# EAGLE design MCMP_Projeto_Final (EAGLE 9.6.2)
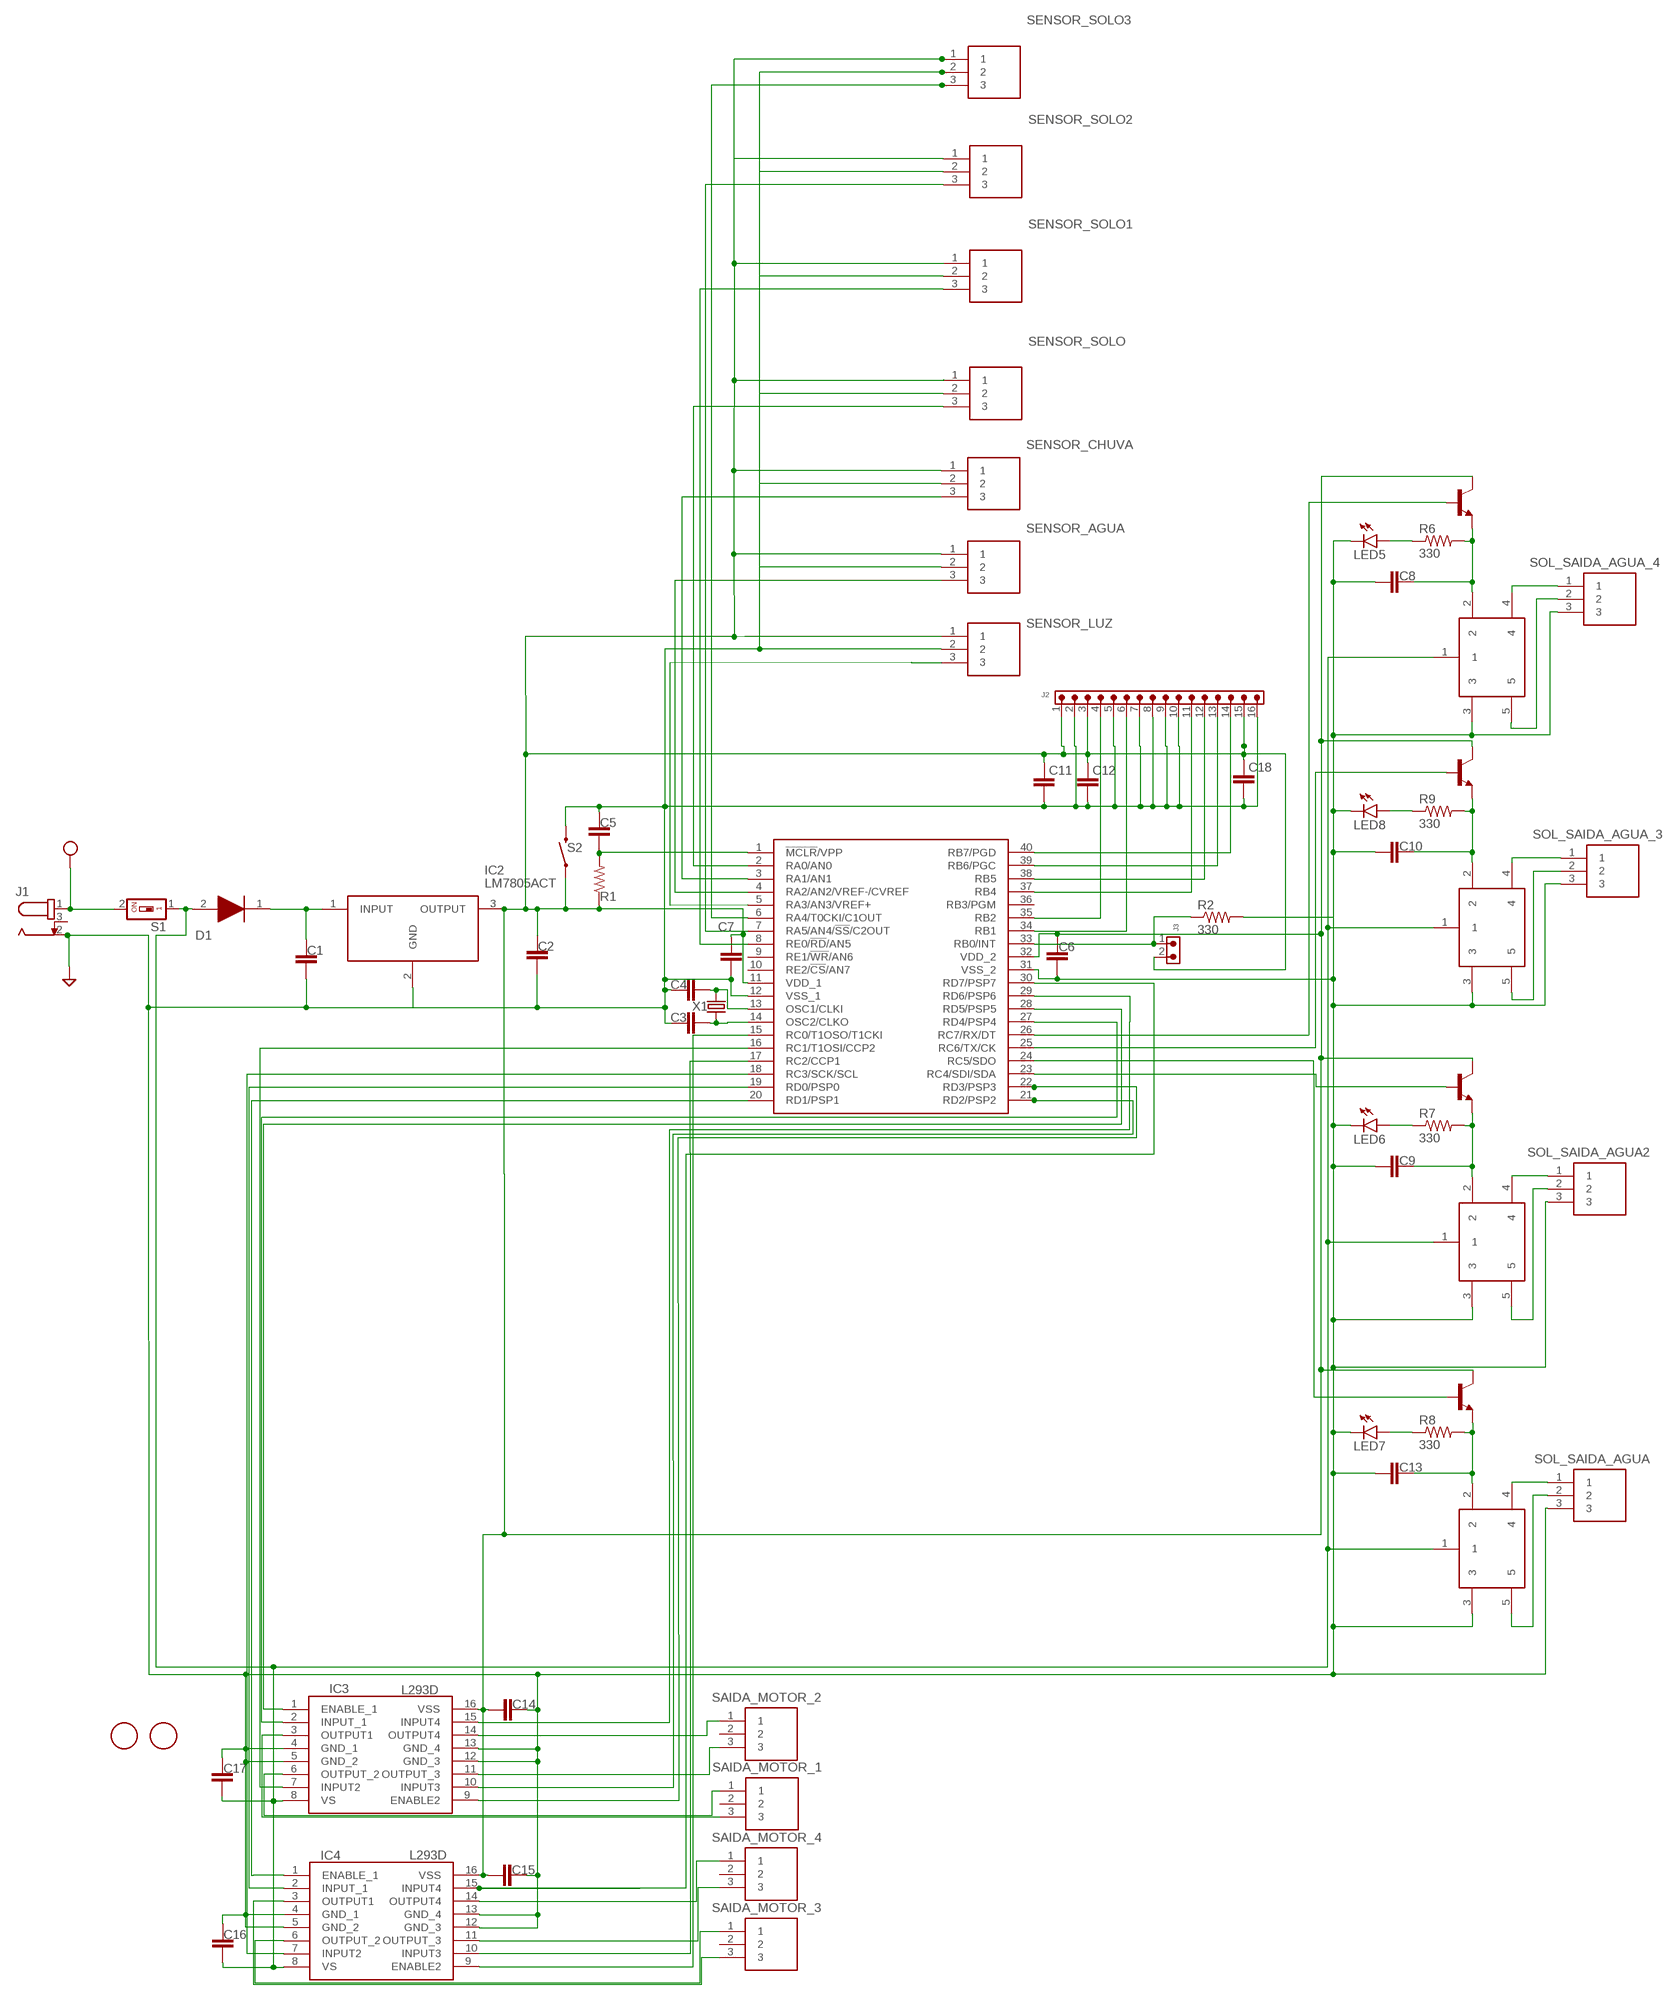
[diagram p0: schematic, sheet 1]

## Parts
C1  470uF  CC0805KRX7R9BB104  [CAP_0805]
C2  1uF  CC0805KRX7R9BB104  [CAP_0805]
C3  33p  CC0805KRX7R9BB104  [CAP_0805]
C4  33p  CC0805KRX7R9BB104  [CAP_0805]
C5  10u  CC0805KRX7R9BB104  [CAP_0805]
C6  10u  CC0805KRX7R9BB104  [CAP_0805]
C7  10u  CC0805KRX7R9BB104  [CAP_0805]
C8  10u  CC0805KRX7R9BB104  [CAP_0805]
C9  10u  CC0805KRX7R9BB104  [CAP_0805]
C10  10u  CC0805KRX7R9BB104  [CAP_0805]
C11  10u  CC0805KRX7R9BB104  [CAP_0805]
C12  10u  CC0805KRX7R9BB104  [CAP_0805]
C13  10u  CC0805KRX7R9BB104  [CAP_0805]
C14  0.1u  CC0805KRX7R9BB104  [CAP_0805]
C15  0.1u  CC0805KRX7R9BB104  [CAP_0805]
C16  100u  CC0805KRX7R9BB104  [CAP_0805]
C17  100u  CC0805KRX7R9BB104  [CAP_0805]
C18  10u  CC0805KRX7R9BB104  [CAP_0805]
D1  1N4007S  [DIOAD1470W65L470D250]
IC1  PIC16F877A-I_P  [DIP1550W56P254L5219H483Q40N]
IC2  LM7805ACT  [TO254P470X1016X2019-3P]
IC3  L293D  [DIP880W50P254L2000H510Q16N]
IC4  L293D  [DIP880W50P254L2000H510Q16N]
J1  694106301002  [694106301002]
J2  6130XX11121_61301611121  [61301611121]
J3  6200XX11121_62000211121  [62000211121]
K1  SRD-05VDC-SL-C  [SRD]
K2  SRD-05VDC-SL-C  [SRD]
K3  SRD-05VDC-SL-C  [SRD]
K5  SRD-05VDC-SL-C  [SRD]
LED5  LEDCHIPLED_0805  [CHIPLED_0805]
LED6  LEDCHIPLED_0805  [CHIPLED_0805]
LED7  LEDCHIPLED_0805  [CHIPLED_0805]
LED8  LEDCHIPLED_0805  [CHIPLED_0805]
Q1  2N1711  [TO39]
Q2  2N1711  [TO39]
Q3  2N1711  [TO39]
Q5  2N1711  [TO39]
R1  10k  CRCW08050000Z0EA  [RES_0805]
R2  330  CRCW08050000Z0EA  [RES_0805]
R6  330  CRCW08050000Z0EA  [RES_0805]
R7  330  CRCW08050000Z0EA  [RES_0805]
R8  330  CRCW08050000Z0EA  [RES_0805]
R9  330  CRCW08050000Z0EA  [RES_0805]
S1  SWS001  [SMS-001]
S2  MOMENTARY-SWITCH-SPST-PTH-6.0MM  [TACTILE_SWITCH_PTH_6.0MM]
SAIDA_MOTOR_1  TB005-762-03BE  [SHDR3W100P0X762_1X3_2286X1260X]
SAIDA_MOTOR_2  TB005-762-03BE  [SHDR3W100P0X762_1X3_2286X1260X]
SAIDA_MOTOR_3  TB005-762-03BE  [SHDR3W100P0X762_1X3_2286X1260X]
SAIDA_MOTOR_4  TB005-762-03BE  [SHDR3W100P0X762_1X3_2286X1260X]
SENSOR_AGUA  TB005-762-03BE  [SHDR3W100P0X762_1X3_2286X1260X]
SENSOR_CHUVA  TB005-762-03BE  [SHDR3W100P0X762_1X3_2286X1260X]
SENSOR_LUZ  TB005-762-03BE  [SHDR3W100P0X762_1X3_2286X1260X]
SENSOR_SOLO  TB005-762-03BE  [SHDR3W100P0X762_1X3_2286X1260X]
SENSOR_SOLO1  TB005-762-03BE  [SHDR3W100P0X762_1X3_2286X1260X]
SENSOR_SOLO2  TB005-762-03BE  [SHDR3W100P0X762_1X3_2286X1260X]
SENSOR_SOLO3  TB005-762-03BE  [SHDR3W100P0X762_1X3_2286X1260X]
SOL_SAIDA_AGUA  TB005-762-03BE  [SHDR3W100P0X762_1X3_2286X1260X]
SOL_SAIDA_AGUA2  TB005-762-03BE  [SHDR3W100P0X762_1X3_2286X1260X]
SOL_SAIDA_AGUA_3  TB005-762-03BE  [SHDR3W100P0X762_1X3_2286X1260X]
SOL_SAIDA_AGUA_4  TB005-762-03BE  [SHDR3W100P0X762_1X3_2286X1260X]
U$5  FIDUCIAL  [FIDUCIAL_1MM]
U$6  FIDUCIAL  [FIDUCIAL_1MM]
X1  4Mhz  5032/2P  [5032/2P]

## Nets
ACIONA_BOBINA_1: IC1.24(RC5/SDO) Q5.2(B)
ACIONA_BOBINA_2: IC1.23(RC4/SDI/SDA) Q2.2(B)
ACIONA_BOBINA_3: IC1.25(RC6/TX/CK) Q3.2(B)
ACIONA_BOBINA_4: IC1.26(RC7/RX/DT) Q1.2(B)
ENABLE_MOTOR_1: IC1.28(RD5/PSP5) IC3.1(ENABLE_1)
ENABLE_MOTOR_2: IC1.22(RD3/PSP3) IC3.9(ENABLE2)
ENABLE_MOTOR_3: IC1.20(RD1/PSP1) IC4.1(ENABLE_1)
ENABLE_MOTOR_4: IC1.15(RC0/T1OSO/T1CKI) IC4.9(ENABLE2)
GND: C1.2 C2.2 C3.1 C4.1 C5.1 C6.2 C7.2 C8.2 C9.2 C10.2 C11.2 C12.2 C13.2 C14.2 C15.1 C16.1 C17.1 C18.2 IC1.12(VSS_1) IC1.31(VSS_2) IC2.2(GND) IC3.4(GND_1) IC3.5(GND_2) IC3.12(GND_3) IC3.13(GND_4) IC4.4(GND_1) IC4.5(GND_2) IC4.12(GND_3) IC4.13(GND_4) J1.2 J2.2 J2.5 J2.7 J2.8 J2.9 J2.10 J2.16 K1.3 K2.3 K3.3 K5.3 LED5.C LED6.C LED7.C LED8.C R2.2 S2.3 SENSOR_AGUA.2 SENSOR_CHUVA.2 SENSOR_LUZ.2 SENSOR_SOLO1.2 SENSOR_SOLO2.2 SENSOR_SOLO3.2 SENSOR_SOLO.2 SOL_SAIDA_AGUA2.3 SOL_SAIDA_AGUA.3 SOL_SAIDA_AGUA_3.3 SOL_SAIDA_AGUA_4.3
INPUT1_MOTOR_1: IC1.27(RD4/PSP4) IC3.2(INPUT_1)
INPUT1_MOTOR_2: IC1.21(RD2/PSP2) IC3.10(INPUT3)
INPUT1_MOTOR_3: IC1.19(RD0/PSP0) IC4.2(INPUT_1)
INPUT1_MOTOR_4: IC1.17(RC2/CCP1) IC4.10(INPUT3)
INPUT2_MOTO_1: IC1.16(RC1/T1OSI/CCP2) IC3.7(INPUT2)
INPUT2_MOTOR_2: IC1.29(RD6/PSP6) IC3.15(INPUT4)
INPUT2_MOTOR_3: IC1.18(RC3/SCK/SCL) IC4.7(INPUT2)
INPUT2_MOTOR_4: IC1.30(RD7/PSP7) IC4.15(INPUT4)
N$1: C1.1 D1.1(K) IC2.1(INPUT)
N$2: IC1.8(RE0/!RD!/AN5) SENSOR_SOLO1.3
N$3: IC1.7(RA5/AN4/!SS!/C2OUT) SENSOR_SOLO2.3
N$4: C5.2 IC1.1(!MCLR!/VPP) R1.2
N$5: C4.2 IC1.13(OSC1/CLKI) X1.2
N$6: C3.2 IC1.14(OSC2/CLKO) X1.1
N$7: IC1.2(RA0/AN0) SENSOR_SOLO.3
N$8: K5.4 SOL_SAIDA_AGUA.1
N$9: IC1.6(RA4/T0CKI/C1OUT) SENSOR_SOLO3.3
N$10: IC1.33(RB0/INT) J3.1 R2.1
N$16: IC1.3(RA1/AN1) SENSOR_CHUVA.3
N$18: IC1.4(RA2/AN2/VREF-/CVREF) SENSOR_AGUA.3
N$21: K1.4 SOL_SAIDA_AGUA_4.1
N$22: LED8.A R9.1
N$24: LED5.A R6.1
N$25: C8.1 K1.2 Q1.1(E) R6.2
N$26: K1.5 SOL_SAIDA_AGUA_4.2
N$27: C13.1 K5.2 Q5.1(E) R8.2
N$30: K5.5 SOL_SAIDA_AGUA.2
N$32: C10.1 K3.2 Q3.1(E) R9.2
N$33: LED6.A R7.1
N$34: C9.1 K2.2 Q2.1(E) R7.2
N$35: K2.4 SOL_SAIDA_AGUA2.1
N$36: K2.5 SOL_SAIDA_AGUA2.2
N$37: LED7.A R8.1
N$38: K3.4 SOL_SAIDA_AGUA_3.1
N$39: K3.5 SOL_SAIDA_AGUA_3.2
N$53: IC1.5(RA3/AN3/VREF+) SENSOR_LUZ.3
OUTPUT1_MOTOR_1: IC3.3(OUTPUT1) SAIDA_MOTOR_1.3
OUTPUT1_MOTOR_2: IC3.11(OUTPUT_3) SAIDA_MOTOR_2.3
OUTPUT1_MOTOR_3: IC4.3(OUTPUT1) SAIDA_MOTOR_3.3
OUTPUT1_MOTOR_4: IC4.11(OUTPUT_3) SAIDA_MOTOR_4.3
OUTPUT2_MOTOR_1: IC3.6(OUTPUT_2) SAIDA_MOTOR_1.1
OUTPUT2_MOTOR_2: IC3.14(OUTPUT4) SAIDA_MOTOR_2.1
OUTPUT2_MOTOR_3: IC4.6(OUTPUT_2) SAIDA_MOTOR_3.1
OUTPUT2_MOTOR_4: IC4.14(OUTPUT4) SAIDA_MOTOR_4.1
RB1: IC1.34(RB1) J2.6
RB2: IC1.35(RB2) J2.4
RB4: IC1.37(RB4) J2.11
RB5: IC1.38(RB5) J2.12
RB6: IC1.39(RB6/PGC) J2.13
RB7: IC1.40(RB7/PGD) J2.14
VCC: J1.1 S1.2 ; supply symbol labelled VCC-CIRCLE
VCC5: C2.1 C6.1 C7.1 C11.1 C12.1 C14.1 C15.2 C18.1 IC1.11(VDD_1) IC1.32(VDD_2) IC2.3(OUTPUT) IC3.16(VSS) IC4.16(VSS) J2.1 J2.3 J2.15 J3.2 Q1.3(C) Q2.3(C) Q3.3(C) Q5.3(C) R1.1 S2.1 SENSOR_AGUA.1 SENSOR_CHUVA.1 SENSOR_LUZ.1 SENSOR_SOLO1.1 SENSOR_SOLO2.1 SENSOR_SOLO3.1 SENSOR_SOLO.1
VCC12: C16.2 C17.2 D1.2(A) IC3.8(VS) IC4.8(VS) K1.1 K2.1 K3.1 K5.1 S1.1
Unconnected: IC1.9(RE1/!WR!/AN6) IC1.10(RE2/!CS!/AN7) IC1.36(RB3/PGM) J1.3 SAIDA_MOTOR_1.2 SAIDA_MOTOR_2.2 SAIDA_MOTOR_3.2 SAIDA_MOTOR_4.2

## Library data of the parts
C1-C18 = Resistor_Capacitor:CC0805KRX7R9BB104: CAP CER 0.1UF 50V X7R 0805 Manufacturer's datasheet <http://www.yageo.com/documents/recent/UPY-GPHC_X7R_6.3V-to-50V_18.pdf>; CREATED_BY: PCBLayout.com; DIGIKEY_PART_NUMBER: 311-1140-2-ND; MANUFACTURER: Yageo; MPN: CC0805KRX7R9BB104; PACKAGE: SMD 0805
D1 = SamacSys_Parts:1N4007S: Rectifiers 1A,1000V,Std SILASTIC Rect Source: Datasheet <https://chawlaelectronic.com/wp-content/uploads/2020/11/1N4007S.pdf>; DESCRIPTION: Rectifiers 1A,1000V,Std SILASTIC Rect; HEIGHT: mm; MANUFACTURER_NAME: Taiwan Semiconductor; MANUFACTURER_PART_NUMBER: 1N4007S; MOUSER_PART_NUMBER: 821-1N4007S; MOUSER_PRICE-STOCK: http://www.mouser.com/Search/ProductDetail.aspx?qs=tHU%2flV7kTySzKYFlWk%2f8oQ%3d%3d
IC1 = SamacSys_Parts:PIC16F877A-I_P: 8-Bit CMOS FLASH Microcontrollers Source: Datasheet <http://componentsearchengine.com/Datasheets/1/PIC16F877A-I_P.pdf>; ARROW_PART_NUMBER: PIC16F877A-I/P; ARROW_PRICE-STOCK: https://www.arrow.com/en/products/pic16f877a-ip/microchip-technology; DESCRIPTION: 8-Bit CMOS FLASH Microcontrollers; HEIGHT: 4.83mm; MANUFACTURER_NAME: Microchip; MANUFACTURER_PART_NUMBER: PIC16F877A-I/P; MOUSER_PART_NUMBER: 579-PIC16F877A-I/P; MOUSER_PRICE-STOCK: https://www.mouser.co.uk/ProductDetail/Microchip-Technology/PIC16F877A-I-P?qs=Vn0zuzr35GH%252Bfm6E5Siyuw%3D%3D
IC2 = SamacSys_Parts:LM7805ACT: ON Semiconductor LM7805ACT Linear Voltage Regulator, 1A, 5 V 3-Pin, TO-220 Source: Datasheet <https://componentsearchengine.com/Datasheets/2/LM7805ACT.pdf>; ARROW_PART_NUMBER: LM7805ACT; ARROW_PRICE-STOCK: https://www.arrow.com/en/products/lm7805act/on-semiconductor; DESCRIPTION: ON Semiconductor LM7805ACT Linear Voltage Regulator, 1A, 5 V 3-Pin, TO-220; HEIGHT: 4.7mm; MANUFACTURER_NAME: ON Semiconductor; MANUFACTURER_PART_NUMBER: LM7805ACT; MOUSER_PART_NUMBER: 512-LM7805ACT; MOUSER_PRICE-STOCK: https://www.mouser.co.uk/ProductDetail/ON-Semiconductor-Fairchild/LM7805ACT?qs=VOMQJJE%252BBNlQknJDd4ZVLg%3D%3D
IC3 IC4 = SamacSys_Parts:L293D: L293D, Motor Driver, 4.5 36 V, 16-Pin Power PDIP Source: Datasheet <http://www.st.com/web/en/resource/technical/document/datasheet/CD00000059.pdf>; ARROW_PART_NUMBER: L293D; ARROW_PRICE-STOCK: https://www.arrow.com/en/products/l293d/stmicroelectronics; DESCRIPTION: L293D, Motor Driver, 4.5 36 V, 16-Pin Power PDIP; HEIGHT: 5.1mm; MANUFACTURER_NAME: STMicroelectronics; MANUFACTURER_PART_NUMBER: L293D; MOUSER_PART_NUMBER: 511-L293D; MOUSER_PRICE-STOCK: https://www.mouser.co.uk/ProductDetail/STMicroelectronics/L293D/?qs=gr8Zi5OG3MgMJ1ICDzLQbg%3D%3D
J1 = DC Power Jacks:694106301002: CONN PWR JACK 2.1X5.5MM SOLDER Manufacturer's datasheet <https://katalog.we-online.de/em/datasheet/6941xx301002.pdf>; CREATED_BY: PCBLayout.com; DIGIKEY_PART_NUMBER: 732-5930-ND; MANUFACTURER: Wurth Electronics Inc.; MPN: 694106301002
J2 = Wurth_Connectors_WR-PHD:6130XX11121_61301611121: WR-PHD 2.54 mm THT Pin Header ARTICLE PROPERTIES: Pins:1;​ 2;​ 3;​ 4;​ 5;​ 6;​ 7;​ 8;​ 9;​ 10;​ 12;​ 13;​ 14;​ 15;​ 16;​ 18;​ 20;​ 22;​ 24;​ 25;​ 32;​ 36;​ 40 KIND PROPERTIES: Pitch：2.54 mm Quality Class:3 as per CECC 75 301-802 Rows：Single Gender：Pin Header Type：Straight MATERIAL PROPERTIES: Insulator Material :PBT Insulator Flammability Rating:UL94 V-0 Contact Material:Copper Alloy Contact Plating:Gold Contact Type:Stamped GENERAL INFORMATION Operating Temperature:-40 up to +105 °C Compliance:RoHS ELECTRICAL PROPERTIES: Rated Current:3 A IR 1:3 A Withstanding Voltage:500 V (AC) Contact Resistance:20 mΩ RISO:1000 MΩ CERTIFICATION UL Approval:E323964 PACKAGING PROPERTIES Packaging:Bag <https://katalog.we-online.com/media/images/v2/o33211v209%20Family_BTB_PHD_6130xx11121.jpg> Details see: https://katalog.we-online.com/en/em/PHD_2_54_THT_PIN_HEADER_6130XX11121 Updated by Yingchun,Shan 2019-10-16 2019 (C) Würth Elektronik; DATASHEET-URL: https://katalog.we-online.com/em/datasheet/61301611121.pdf; GENDER: Pin Header; IR: 3A; MATES: WR-PHD 2.54mm Angled Socket Header /SMT Socket Header/Socket Header; PACKAGING: Bag; PART-NUMBER: 61301611121; PINS: 16; ROWS: Single; TYPE: Straight
J3 = Wurth_Connectors_WR-PHD:6200XX11121_62000211121: WR-PHD 2.00 mm THT Pin Header ARTICLE PROPERTIES: Pins:2;​ 3;​ 4;​ 6;​ 8;​ 10;​ 20;​ 32 KIND PROPERTIES: Pitch：2 mm Quality Class:3 as per CECC 75 301-802 Rows：Single Gender：Pin Header Type：Straight MATERIAL PROPERTIES: Insulator Material :PA9T Insulator Flammability Rating:UL94 V-0 Contact Material:Copper Alloy Contact Plating:Gold Contact Type:Stamped GENERAL INFORMATION Operating Temperature:-40 up to +105 °C Compliance:Lead free / RoHS ELECTRICAL PROPERTIES: Rated Current:max.;​ 2 A IR 1:2A Withstanding Voltage:500 V (AC) Contact Resistance:20 mΩ RISO:1000 MΩ CERTIFICATION UL Approval:E323964 PACKAGING PROPERTIES Packaging:Bag Packaging Unit:1000;​ 500;​ 300;​ 200 <https://katalog.we-online.com/media/images/v2/o33219v209%20Family_WR-PHD_6200xx11121.jpg> Details see: https://katalog.we-online.com/en/em/PHD_2_00_THT_PIN_HEADER_6200XX11121 Updated by Yingchun,Shan 2019-10-24 2019 (C) Würth Elektronik; DATASHEET-URL: https://katalog.we-online.com/em/datasheet/62000211121.pdf; GENDER: Pin Header; IR: 2A; MATES: WR-PHD 2.0mm Socket Header; PACKAGING: Bag; PART-NUMBER: 62000211121; PINS: 2; ROWS: Single; TYPE: Straight
K1-K3 K5 = SamacSys_Parts:SRD-05VDC-SL-C: Relay Source: Datasheet <http://files.microjpm.webnode.com/200001010-dda41de9e1/Songle Relay Datasheet.pdf>; DESCRIPTION: Relay; HEIGHT: mm; MANUFACTURER_NAME: Songle Relay; MANUFACTURER_PART_NUMBER: SRD-05VDC-SL-C
LED5-LED8 = led:LED: LED OSRAM: - CHIPLED LG R971, LG N971, LY N971, LG Q971, LY Q971, LO R971, LY R971 LH N974, LH R974 LS Q976, LO Q976, LY Q976 LO Q996 - Hyper CHIPLED LW Q18S LB Q993, LB Q99A, LB R99A - SideLED LS A670, LO A670, LY A670, LG A670, LP A670 LB A673, LV A673, LT A673, LW A673 LH A674 LY A675 LS A676, LA A676, LO A676, LY A676, LW A676 LS A679, LY A679, LG A679 - Hyper Micro SIDELED® LS Y876, LA Y876, LO Y876, LY Y876 LT Y87S - SmartLED LW L88C, LW L88S LB L89C, LB L89S, LG L890 LS L89K, LO L89K, LY L89K LS L896, LA L896, LO L896, LY L896 - TOPLED LS T670, LO T670, LY T670, LG T670, LP T670 LSG T670, LSP T670, LSY T670, LOP T670, LYG T670 LG T671, LOG T671, LSG T671 LB T673, LV T673, LT T673, LW T673 LH T674 LS T676, LA T676, LO T676, LY T676, LB T676, LH T676, LSB T676, LW T676 LB T67C, LV T67C, LT T67C, LS T67K, LO T67K, LY T67K, LW E67C LS E67B, LA E67B, LO E67B, LY E67B, LB E67C, LV E67C, LT E67C LW T67C LS T679, LY T679, LG T679 LS T770, LO T770, LY T770, LG T770, LP T770 LB T773, LV T773, LT T773, LW T773 LH T774 LS E675, LA E675, LY E675, LS T675 LS T776, LA T776, LO T776, LY T776, LB T776 LHGB T686 LT T68C, LB T68C - Hyper Mini TOPLED® LB M676 - Mini TOPLED Santana® LG M470 LS M47K, LO M47K, LY M47K Source: http://www.osram.convergy.de LUXEON: - LUMILED® LXK2-PW12-R00, LXK2-PW12-S00, LXK2-PW14-U00, LXK2-PW14-V00 LXK2-PM12-R00, LXK2-PM12-S00, LXK2-PM14-U00 LXK2-PE12-Q00, LXK2-PE12-R00, LXK2-PE12-S00, LXK2-PE14-T00, LXK2-PE14-U00 LXK2-PB12-K00, LXK2-PB12-L00, LXK2-PB12-M00, LXK2-PB14-N00, LXK2-PB14-P00, LXK2-PB14-Q00 LXK2-PR12-L00, LXK2-PR12-M00, LXK2-PR14-Q00, LXK2-PR14-R00 LXK2-PD12-Q00, LXK2-PD12-R00, LXK2-PD12-S00 LXK2-PH12-R00, LXK2-PH12-S00 LXK2-PL12-P00, LXK2-PL12-Q00, LXK2-PL12-R00 Source: www.luxeon.com KINGBRIGHT: KA-3528ASYC Source: www.kingbright.com
Q1-Q3 Q5 = transistor-npn:2N1711: NPN Transistor
R1 R2 R6-R9 = Resistor_Capacitor:CRCW08050000Z0EA: RES SMD 0 OHM JUMPER 1/8W 0805 Manufacturer's datasheet <http://www.vishay.com/docs/20035/dcrcwe3.pdf>; CREATED_BY: PCBLayout.com; DIGIKEY_PART_NUMBER: 541-0.0ATR-ND; MANUFACTURER: Vishay Dale; MPN: CRCW08050000Z0EA; PACKAGE: SMD 0805
S1 = smd-special:SWS001: SMD Dip Switch 1 pol.
S2 = SparkFun-Switches:MOMENTARY-SWITCH-SPST: Momentary Switch (Pushbutton) - SPST Normally-open (NO) SPST momentary switches (buttons, pushbuttons). Variants PTH-12MM - 12mm square, through-hole Momentary Pushbutton Switch - 12mm Square <https://www.sparkfun.com/products/9190> (COM-09190) PTH-6.0MM, PTH-6.0MM-KIT - 6.0mm square, through-hole Mini Pushbutton Switch <https://www.sparkfun.com/products/97> (COM-00097) KIT package intended for soldering kit's - only one side of pads' copper is exposed. PTH-RIGHT-ANGLE-KIT - Right-angle, through-hole Right Angle Tactile Button <https://www.sparkfun.com/products/10791> - Used on SparkFun BigTime Watch Kit <https://www.sparkfun.com/products/11734> SMD-12MM - 12mm square, surface-mount Tactile Button - SMD (12mm) <https://www.sparkfun.com/products/12993> (COM-12993) Used on SparkFun PicoBoard <https://www.sparkfun.com/products/11888> SMD-4.5MM - 4.5mm Square Trackball Switch Used on SparkFun Blackberry Trackballer Breakout <https://www.sparkfun.com/products/13169> SMD-4.6MMX2.8MM - 4.60mm x 2.80mm, surface mount Used on SparkFun SAMD21 Mini Breakout <https://www.sparkfun.com/products/13664> SMD-5.2MM, SMD-5.2-REDUNDANT - 5.2mm square, surface-mount Mini Pushbutton Switch - SMD <https://www.sparkfun.com/products/8720> (COM-08720) Used on Arduino Pro Mini <https://www.sparkfun.com/products/11114> REDUNDANT package connects both switch circuits together SMD-6.0X3.5MM - 6.0 x 3.5mm, surface mount Momentary Reset Switch SMD <https://www.sparkfun.com/products/8229> (COM-08229) SMD-6.2MM-TALL - 6.2mm square, surface mount Tactile Button - SMD (6mm) <https://www.sparkfun.com/products/12992> Used on SparkFun Digital Sandbox <https://www.sparkfun.com/products/12651> SMD-RIGHT-ANGLE - Right-angle, surface mount Used on SparkFun Block for Intel® Edison - Arduino <https://www.sparkfun.com/products/13036>; PROD_ID: SWCH-08441; SF_SKU: COM-00097
SAIDA_MOTOR_1-SAIDA_MOTOR_4 SENSOR_AGUA SENSOR_CHUVA SENSOR_LUZ SENSOR_SOLO SENSOR_SOLO1-SENSOR_SOLO3 SOL_SAIDA_AGUA SOL_SAIDA_AGUA2 SOL_SAIDA_AGUA_3 SOL_SAIDA_AGUA_4 = SamacSys_Parts:TB005-762-03BE: Fixed Terminal Blocks Terminal block, screw type, 7.62 , horizontal, 3 poles, CUI Blue, slotted screw, PCB mount Source: Datasheet <https://componentsearchengine.com/Datasheets/1/TB005-762-03BE.pdf>; ARROW_PART_NUMBER: TB005-762-03BE; ARROW_PRICE-STOCK: https://www.arrow.com/en/products/tb005-762-03be/cui-devices; DESCRIPTION: Fixed Terminal Blocks Terminal block, screw type, 7.62 , horizontal, 3 poles, CUI Blue, slotted screw, PCB mount; HEIGHT: 21.7mm; MANUFACTURER_NAME: CUI Inc.; MANUFACTURER_PART_NUMBER: TB005-762-03BE; MOUSER_PART_NUMBER: 490-TB005-762-03BE; MOUSER_PRICE-STOCK: https://www.mouser.co.uk/ProductDetail/CUI-Devices/TB005-762-03BE?qs=vLWxofP3U2y%2FNPoVLYDJfQ%3D%3D
U$5 U$6 = adafruit:FIDUCIAL: For use by pick and place machines to calibrate the vision/machine, 1mm By microbuilder.eu
X1 = Crystals_Oscillators:5032/2P: Crystal Manufacturer's datasheet <https://datasheet.octopart.com/5032-2P-Xinhunjing-datasheet-30677175.pdf>; CREATED_BY: PCBLayout.com; MANUFACTURER: Xinhunjing; MPN: 5032/2P; PACKAGE: SMD

## Board
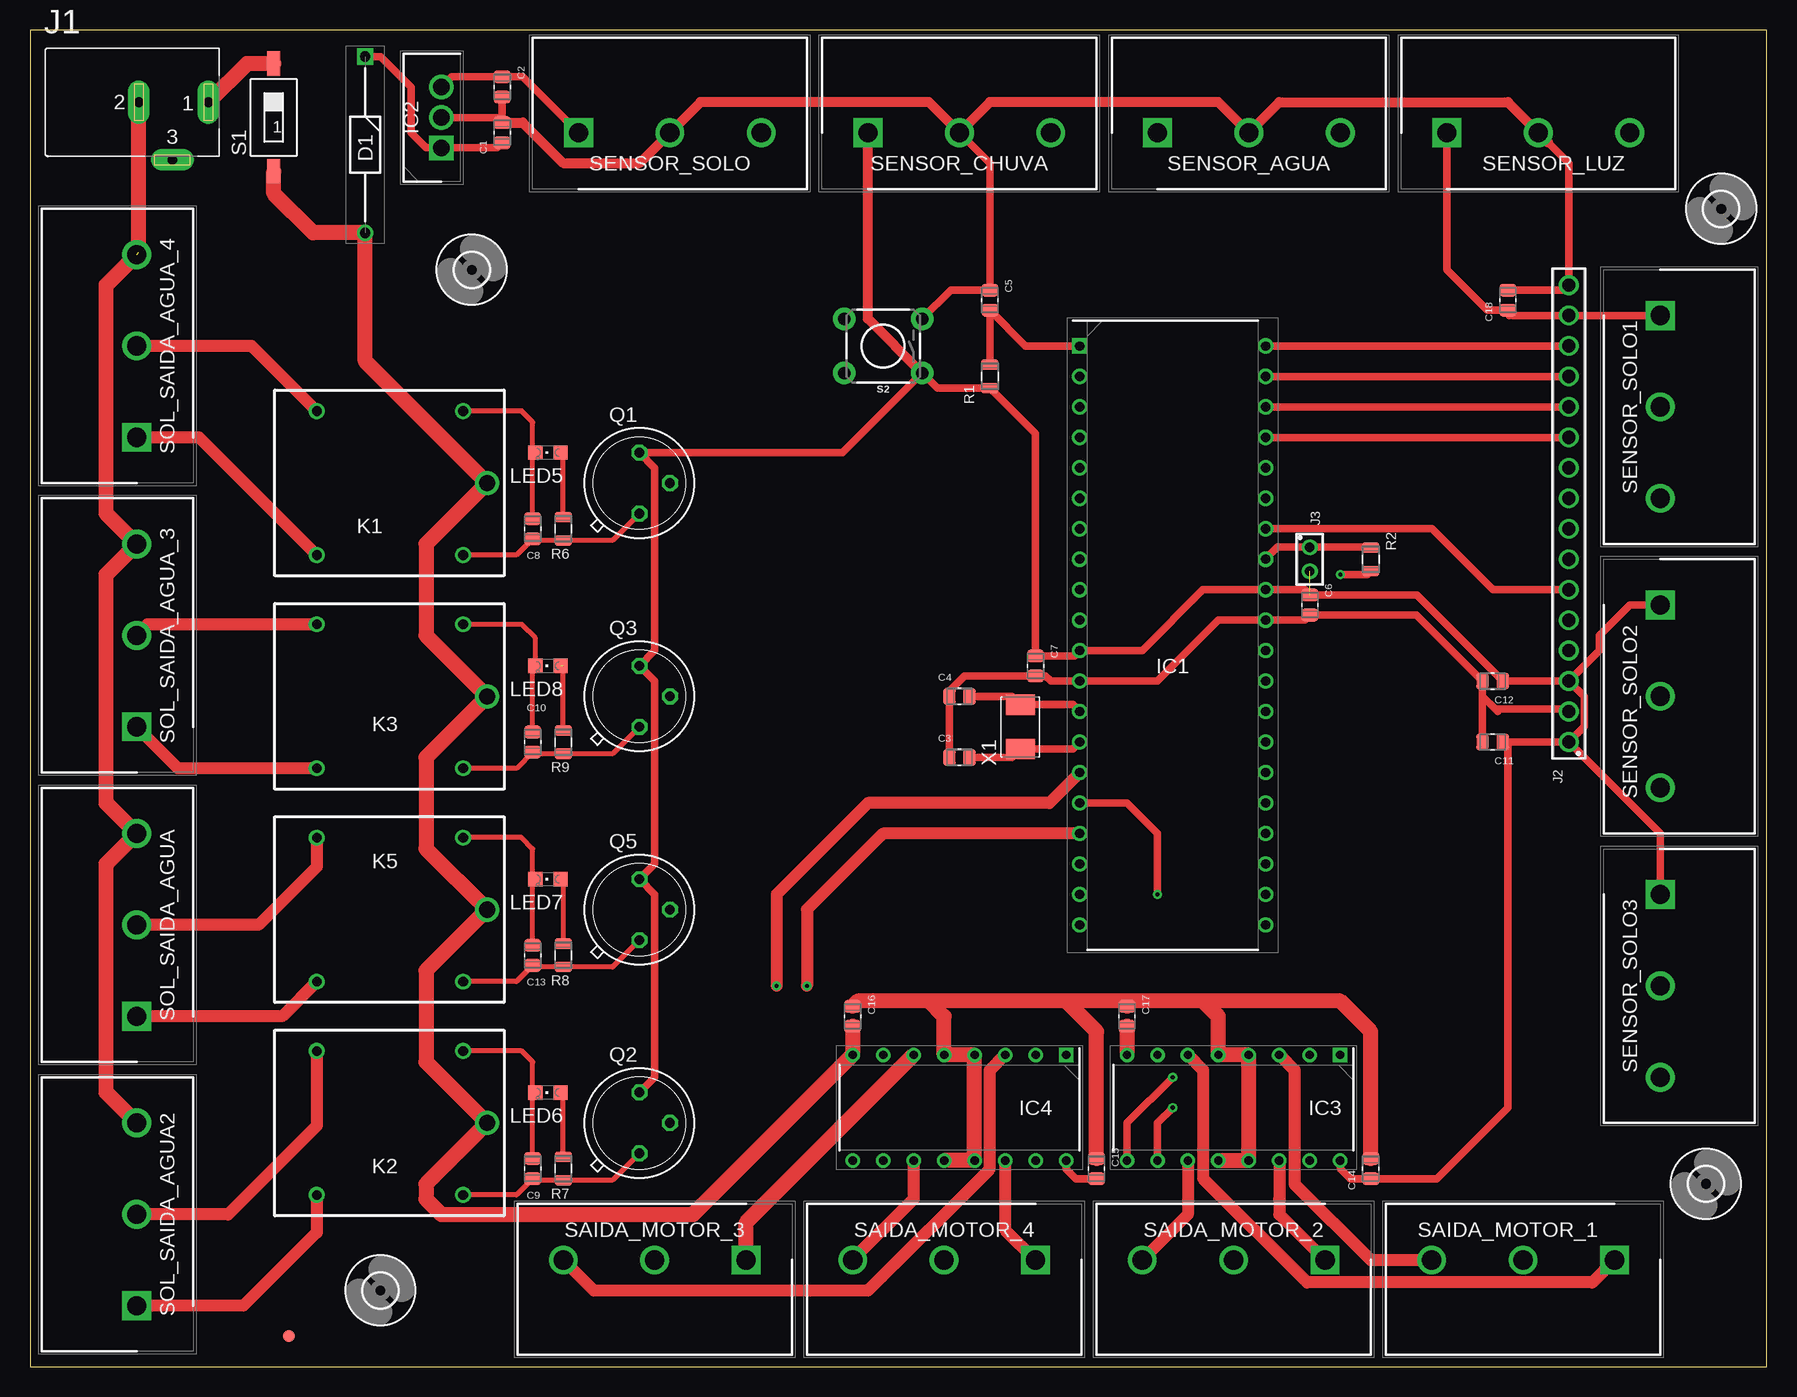
[diagram p1: board, top side]
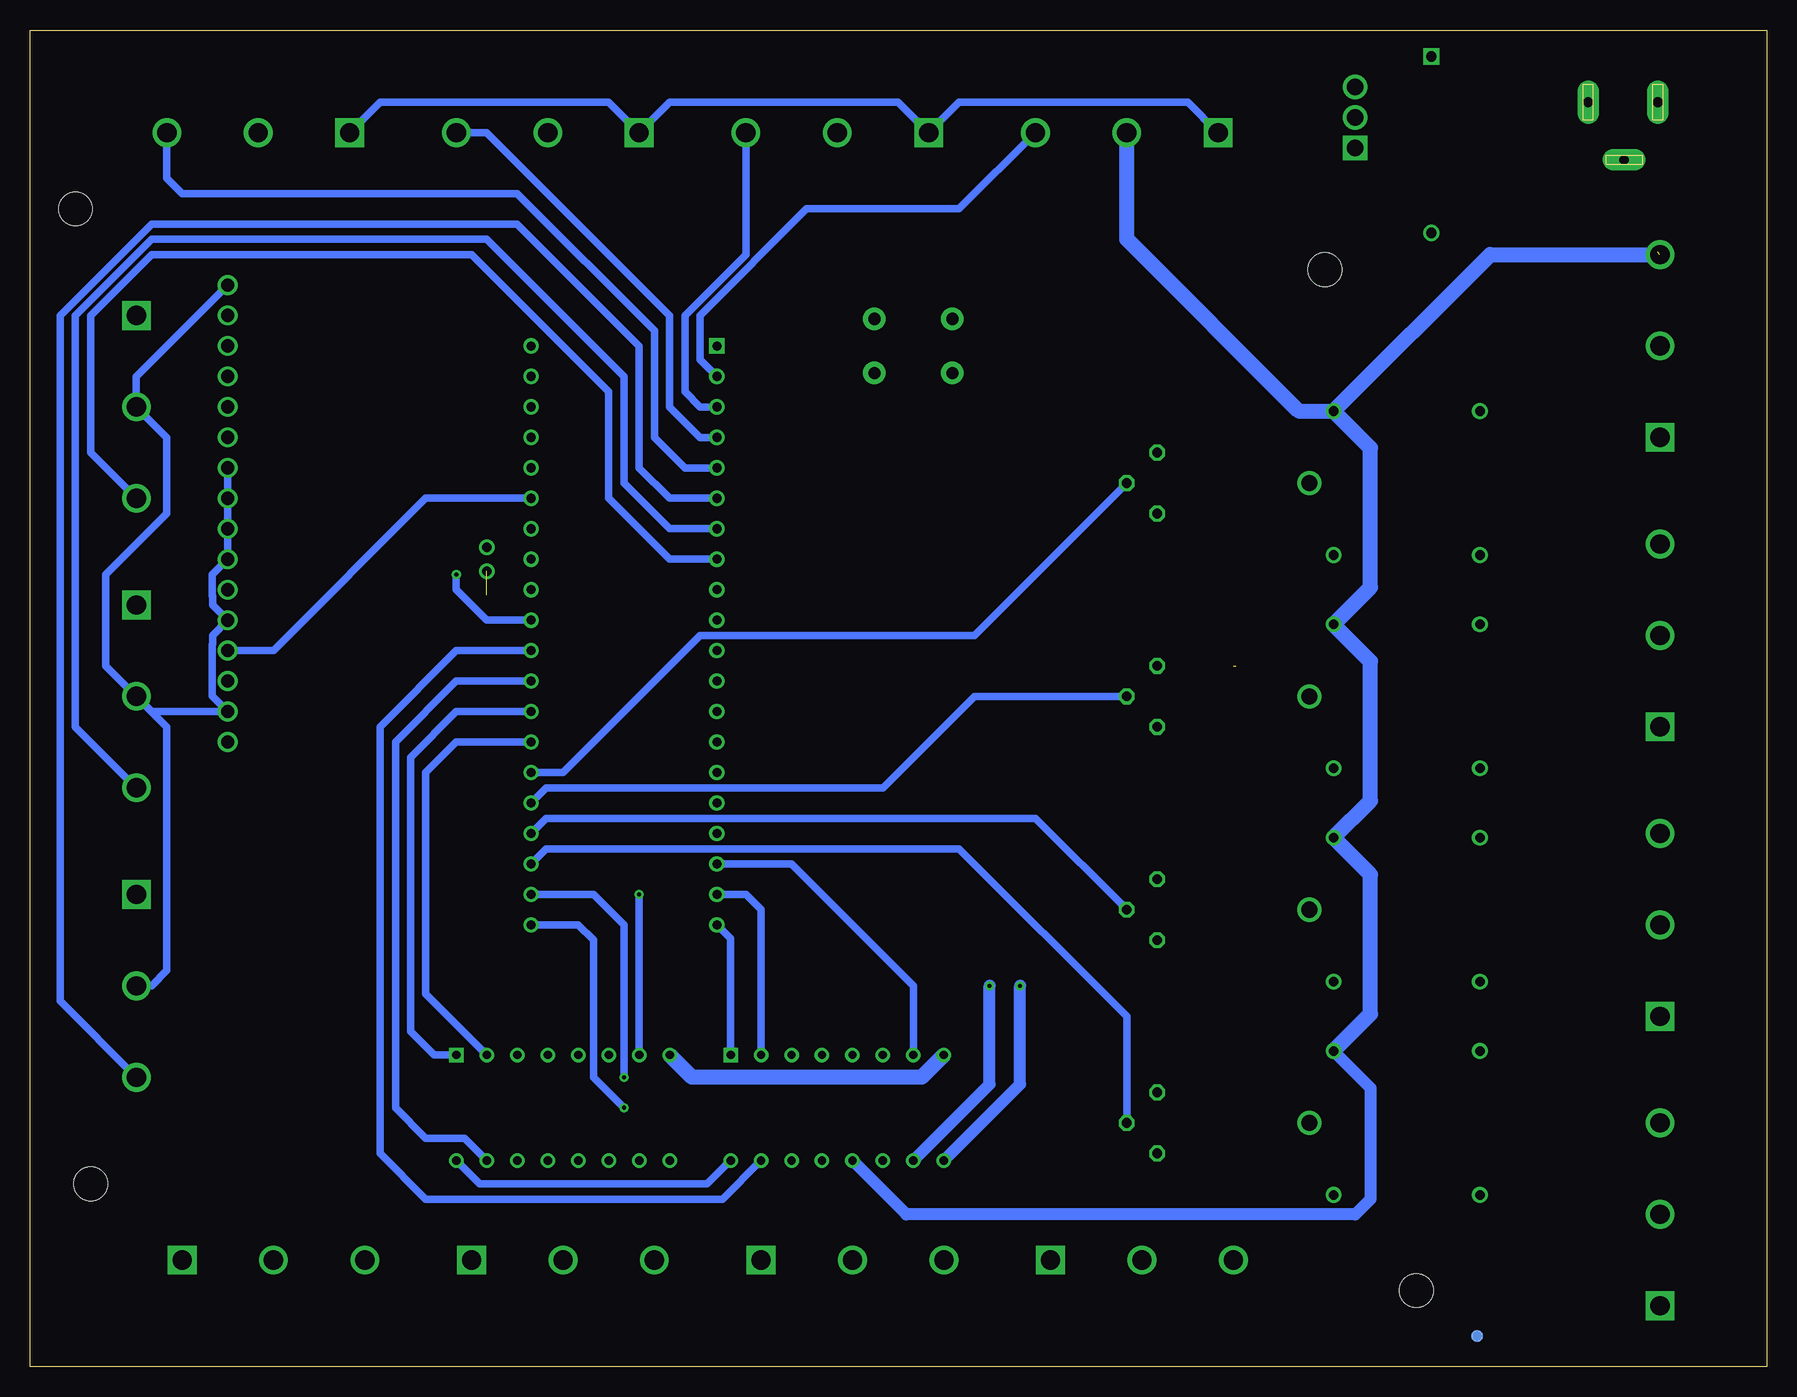
[diagram p2: board, bottom side, seen from below]

Size 144.76 x 111.43 mm. Coordinates in mm from the lower left corner, seen from the top.
Outline: 0,0 144.76,0 144.76,111.43 0,111.43 0,0
Copper layers (1*16): Top 0.035mm / dielectric 1.5mm / Bottom 0.035mm
Design rules "default *": minimum track width 6mil, minimum drill 0.35mm, track to track 5mil, track to pad 6mil, pad to pad 6mil, via to via 6mil, smd to smd 6mil, copper to edge 40mil, drill to drill 6mil, minimum pad ring 10mil, minimum via ring 8mil, stop-mask expansion 4mil, vias tented up to drill 0mil, thermal gap 10mil

### Footprints (pad centres in the part's own frame; a part is rotated, then mirrored left to right if it is on the bottom)
CAP_0805 = smd 1.05 x 1.38: 1 -0.84,0; 2 0.84,0
DIOAD1470W65L470D250 = drill 0.85 pad 1.275 square: 1 0,0 | drill 0.85 pad 1.275: 2 14.7,0
DIP1550W56P254L5219H483Q40N = drill 0.76 pad 1.16 square: 1 -7.748,24.13 | drill 0.76 pad 1.16: 2 -7.748,21.59; 3 -7.748,19.05; 4 -7.748,16.51; 5 -7.748,13.97; 6 -7.748,11.43; 7 -7.748,8.89; 8 -7.748,6.35; 9 -7.748,3.81; 10 -7.748,1.27; 11 -7.748,-1.27; 12 -7.748,-3.81; 13 -7.748,-6.35; 14 -7.748,-8.89; 15 -7.748,-11.43; 16 -7.748,-13.97; 17 -7.748,-16.51; 18 -7.748,-19.05; 19 -7.748,-21.59; 20 -7.748,-24.13; 21 7.748,-24.13; 22 7.748,-21.59; 23 7.748,-19.05; 24 7.748,-16.51; 25 7.748,-13.97; 26 7.748,-11.43; 27 7.748,-8.89; 28 7.748,-6.35; 29 7.748,-3.81; 30 7.748,-1.27; 31 7.748,1.27; 32 7.748,3.81; 33 7.748,6.35; 34 7.748,8.89; 35 7.748,11.43; 36 7.748,13.97; 37 7.748,16.51; 38 7.748,19.05; 39 7.748,21.59; 40 7.748,24.13
TO254P470X1016X2019-3P = drill 1.37 pad 2.055 square: 1 0,0 | drill 1.37 pad 2.055: 2 2.535,0; 3 5.07,0
DIP880W50P254L2000H510Q16N = drill 0.7 pad 1.1 square: 1 -4.4,8.89 | drill 0.7 pad 1.1: 2 -4.4,6.35; 3 -4.4,3.81; 4 -4.4,1.27; 5 -4.4,-1.27; 6 -4.4,-3.81; 7 -4.4,-6.35; 8 -4.4,-8.89; 9 4.4,-8.89; 10 4.4,-6.35; 11 4.4,-3.81; 12 4.4,-1.27; 13 4.4,1.27; 14 4.4,3.81; 15 4.4,6.35; 16 4.4,8.89
694106301002 = drill 0.8 pad 1.8 long: 1 13.6,0; 2 7.8,0; 3 10.6,-4.8
61301611121 = drill 1.1: 1 -19.05,0; 2 -16.51,0; 3 -13.97,0; 4 -11.43,0; 5 -8.89,0; 6 -6.35,0; 7 -3.81,0; 8 -1.27,0; 9 1.27,0; 10 3.81,0; 11 6.35,0; 12 8.89,0; 13 11.43,0; 14 13.97,0; 15 16.51,0; 16 19.05,0
62000211121 = drill 0.8: 1 -1,0; 2 1,0
SRD = drill 1.34 pad 1.84: 1 0,0 | drill 0.8 pad 1.3: 2 2,6; 3 2,-6; 4 14.2,6; 5 14.2,-6
CHIPLED_0805 = smd 1.2 x 1.2: A 0,-1.05; C 0,1.05
TO39 = drill 0.813 octagon: 1 0,-2.54; 2 2.54,0; 3 0,2.54
RES_0805 = smd 0.87 x 1.42: 1 -0.975,0; 2 0.975,0
SMS-001 = smd 1.092 x 2.007: 1 0,-4.496; 2 0,4.496
TACTILE_SWITCH_PTH_6.0MM = drill 1.016 pad 1.88: 1 -3.251,2.261; 2 3.251,2.261; 3 -3.251,-2.261; 4 3.251,-2.261
SHDR3W100P0X762_1X3_2286X1260X = drill 1.6 pad 2.4 square: 1 0,0 | drill 1.6 pad 2.4: 2 7.62,0; 3 15.24,0
2,8 = hole 2.8: 0,0
FIDUCIAL_1MM = smd 1 x 1: 1 0,0
5032/2P = smd 1.7 x 2.4: 1 -1.85,0; 2 1.85,0

### Placement (x,y rotation side)
C1  39.37,102.87 90 top
C2  39.37,106.68 270 top
C3  77.47,50.8 0 top
C4  77.47,55.88 0 top
C5  80.01,88.9 270 top
C6  106.68,63.5 270 top
C7  83.82,58.42 270 top
C8  41.91,69.85 90 top
C9  41.91,16.51 90 top
C10  41.91,52.07 90 top
C11  121.92,52.07 180 top
C12  121.92,57.15 180 top
C13  41.91,34.29 90 top
C14  111.76,16.51 90 top
C15  88.9,16.51 270 top
C16  68.58,29.21 270 top
C17  91.44,29.21 270 top
C18  123.19,88.9 90 top
D1  27.94,109.22 270 top
IC1  95.25,60.96 0 top
IC2  34.29,101.6 90 top
IC3  100.33,21.59 270 top
IC4  77.47,21.59 270 top
J1  1.27,105.41 0 top
J2  128.27,71.12 90 top
J3  106.68,67.31 270 top
K1  38.1,73.66 180 top
K2  38.1,20.32 180 top
K3  38.1,55.88 180 top
K5  38.1,38.1 180 top
LED5  43.18,76.2 90 top
LED6  43.18,22.86 90 top
LED7  43.18,40.64 90 top
LED8  43.18,58.42 90 top
Q1  50.8,73.66 0 top
Q2  50.8,20.32 0 top
Q3  50.8,55.88 0 top
Q5  50.8,38.1 0 top
R1  80.01,82.55 90 top
R2  111.76,67.31 270 top
R6  44.45,69.85 270 top
R7  44.45,16.51 270 top
R8  44.45,34.29 270 top
R9  44.45,52.07 270 top
S1  20.32,104.14 0 top
S2  71.12,85.09 180 top
SAIDA_MOTOR_1  132.08,8.89 180 top
SAIDA_MOTOR_2  107.95,8.89 180 top
SAIDA_MOTOR_3  59.69,8.89 180 top
SAIDA_MOTOR_4  83.82,8.89 180 top
SENSOR_AGUA  93.98,102.87 0 top
SENSOR_CHUVA  69.85,102.87 0 top
SENSOR_LUZ  118.11,102.87 0 top
SENSOR_SOLO  45.72,102.87 0 top
SENSOR_SOLO1  135.89,87.63 270 top
SENSOR_SOLO2  135.89,63.5 270 top
SENSOR_SOLO3  135.89,39.37 270 top
SOL_SAIDA_AGUA  8.89,29.21 90 top
SOL_SAIDA_AGUA2  8.89,5.08 90 top
SOL_SAIDA_AGUA_3  8.89,53.34 90 top
SOL_SAIDA_AGUA_4  8.89,77.47 90 top
U$1  [2,8]  139.7,15.24 0 top
U$2  [2,8]  29.21,6.35 0 top
U$3  [2,8]  36.83,91.44 0 top
U$4  [2,8]  140.97,96.52 0 top
U$5  21.59,2.54 0 top
U$6  24.13,2.54 0 bottom
X1  82.55,53.34 90 top

### Tracks (layer width: path | path; a pad name or v marks a point on that pad's centre or on a via)
ACIONA_BOBINA_1
  Bottom 0.61: Q5.2 60.96,45.72 101.73,45.72 IC1.24
ACIONA_BOBINA_2
  Bottom 0.61: Q2.2 53.34,29.21 67.31,43.18 101.73,43.18 IC1.23
ACIONA_BOBINA_3
  Bottom 0.61: Q3.2 66.04,55.88 73.66,48.26 101.73,48.26 IC1.25
ACIONA_BOBINA_4
  Bottom 0.61: IC1.26 100.33,49.53 88.9,60.96 66.04,60.96 Q1.2
ENABLE_MOTOR_1
  Bottom 0.61: IC1.28 109.22,54.61 113.03,50.8 113.03,27.94 111.08,25.99 IC3.1
ENABLE_MOTOR_2  (via drill 0.35)
  Top 0.61: IC3.9 91.44,20.32 v95.25,24.13
  Bottom 0.61: IC1.22 97.79,39.37 95.25,36.83 v95.25,24.13
ENABLE_MOTOR_3
  Bottom 0.61: IC1.20 86.36,35.69 IC4.1
ENABLE_MOTOR_4  (via drill 0.35)
  Top 1.016: IC1.15 84.96,46.99 69.85,46.99 62.23,39.37 v62.23,31.75
  Bottom 1.016: IC4.9 62.23,23.54 v62.23,31.75
GND  (via drill 0.35)  (1 unrouted)
  Top 0.406: C9.2 41.91,22.64 LED6.C 41.91,23.08 41.91,25.4 40.99,26.32 K2.3 | C13.2 41.91,40.42 LED7.C 41.91,40.86 41.91,43.18 40.99,44.1 K5.3 | C10.2 41.91,58.2 LED8.C 42.13,60.74 40.99,61.88 K3.3 | LED5.C 42.02,76.31 | 42.02,76.31 41.91,76.42 41.91,78.74 40.99,79.66 K1.3 | C8.2 41.91,76.2 42.02,76.31
  Top 0.61: C11.2 121.08,55.88 | 121.08,55.88 C12.2 115.57,62.66 C6.2 106.25,62.23 IC1.31 99.06,62.23 93.98,57.15 IC1.12 85.09,57.15 84.66,57.58 C7.2 77.9,57.58 76.63,56.31 C4.1 C3.1 | 122.35,54.61 122.14,54.83 | 122.14,54.83 121.08,55.88 | S2.3 76.76,89.74 C5.1 80.01,100.33 SENSOR_CHUVA.2 | C2.2 C1.2 38.95,104.13 IC2.2 | C18.2 127.84,89.74 J2.16 128.27,100.33 SENSOR_LUZ.2 | 122.14,54.83 128.06,54.83 J2.2 | R2.2 111.47,66.04 v109.22,66.04
  Top 0.813: 126.53,102.07 SENSOR_LUZ.2 123.19,105.41 104.14,105.41 SENSOR_AGUA.2 99.06,105.41 80.01,105.41 SENSOR_CHUVA.2 74.93,105.41 55.88,105.41 SENSOR_SOLO.2 50.8,100.33 44.45,100.33 41.07,103.71 C1.2
  Top 1.27: 9.07,92.89 J1.2 | SOL_SAIDA_AGUA2.3 6.35,22.86 6.35,41.91 SOL_SAIDA_AGUA.3 6.35,46.99 6.35,66.04 SOL_SAIDA_AGUA_3.3 6.35,71.12 6.35,90.17 SOL_SAIDA_AGUA_4.3 | IC4.12 IC4.13 IC4.4 IC4.5 76.2,29.21 74.93,30.48 | IC3.12 IC3.13 IC3.4 IC3.5 99.06,29.21 97.79,30.48 | 97.79,30.48 91.87,30.48 | 91.87,30.48 C17.1 91.01,30.48 | 74.93,30.48 69.01,30.48 C16.1 | 91.01,30.48 86.36,30.48 | 86.36,30.48 74.93,30.48 | C15.1 88.9,27.94 86.36,30.48 | C14.2 111.76,27.94 109.22,30.48 97.79,30.48 | 91.87,30.48 91.01,30.48
  Bottom 0.61: J2.16 135.89,82.55 SENSOR_SOLO1.2 133.35,77.47 133.35,71.12 138.43,66.04 138.43,58.42 SENSOR_SOLO2.2 | J2.10 J2.9 J2.8 J2.7 129.55,66.03 129.55,64.24 129.54,64.23 129.54,63.5 J2.5 129.54,60.96 129.54,60.23 129.55,60.22 129.55,55.89 J2.2 | J2.2 129.54,55.88 | SENSOR_SOLO3.2 134.62,31.75 133.35,33.02 133.35,53.34 SENSOR_SOLO2.2 | SENSOR_SOLO2.2 134.62,54.61 J2.2 | IC1.31 106.68,62.23 109.22,64.77 v109.22,66.04
  Bottom 1.016: K2.3 33.02,23.24 33.02,13.97 34.29,12.7 71.71,12.7 IC4.12
  Bottom 1.27: K2.3 33.02,29.4 33.02,41.02 K5.3 33.02,47.18 33.02,58.8 K3.3 33.02,64.96 33.02,76.58 K1.3 | K1.3 23.05,92.71 SOL_SAIDA_AGUA_4.3 | K1.3 39.02,79.66 53.34,93.98 SENSOR_SOLO.2
INPUT1_MOTOR_1
  Bottom 0.61: IC1.27 109.22,52.07 111.76,49.53 111.76,31.07 IC3.2
INPUT1_MOTOR_2  (via drill 0.35)
  Top 0.61: IC3.10 93.98,20.32 v95.25,21.59
  Bottom 0.61: IC1.21 99.06,36.83 97.79,35.56 97.79,26.67 | 97.79,26.67 97.79,25.4 | 97.79,26.67 | 97.79,26.67 97.79,24.13 v95.25,21.59
INPUT1_MOTOR_3
  Bottom 0.61: IC4.2 83.82,38.1 85.09,39.37 IC1.19
INPUT1_MOTOR_4  (via drill 0.35)
  Top 1.016: IC1.17 71.12,44.45 64.77,38.1 v64.77,31.75
  Bottom 1.016: IC4.10 64.77,23.54 v64.77,31.75
INPUT2_MOTO_1  (via drill 0.35)
  Top 0.61: IC1.16 91.44,46.99 93.98,44.45 v93.98,39.37
  Bottom 0.61: IC3.7 v93.98,39.37
INPUT2_MOTOR_2
  Bottom 0.61: IC1.29 109.22,57.15 114.3,52.07 114.3,21.59 111.76,19.05 108.54,19.05 IC3.15
INPUT2_MOTOR_3
  Bottom 0.61: IC4.7 71.12,31.75 81.28,41.91 IC1.18
INPUT2_MOTOR_4
  Bottom 0.61: IC1.30 109.22,59.69 115.57,53.34 115.57,17.78 111.76,13.97 87.04,13.97 IC4.15
N$1
  Top 0.61: D1.1 29.21,109.22 31.75,106.68 31.75,102.87 33.02,101.6 IC2.1 38.94,101.6 C1.1
N$2
  Bottom 0.61: SENSOR_SOLO1.3 139.7,76.2 139.7,87.63 134.62,92.71 107.95,92.71 96.52,81.28 96.52,72.39 91.44,67.31 IC1.8
N$3
  Bottom 0.61: SENSOR_SOLO2.3 140.97,53.34 140.97,87.63 134.62,93.98 106.68,93.98 95.25,82.55 95.25,73.66 91.44,69.85 IC1.7
N$4
  Top 0.61: IC1.1 82.98,85.09 C5.2 R1.2
N$5
  Top 0.61: C4.2 81.86,55.88 X1.2 86.92,55.19 IC1.13
N$6
  Top 0.61: IC1.14 86.92,51.49 X1.1 81.86,50.8 C3.2
N$7
  Bottom 0.61: IC1.2 88.9,83.95 88.9,87.63 80.01,96.52 67.31,96.52 SENSOR_SOLO.3
N$8
  Top 1.016: K5.4 21.01,29.21 SOL_SAIDA_AGUA.1
N$9
  Bottom 0.61: IC1.6 91.44,72.39 93.98,74.93 93.98,85.09 104.14,95.25 134.62,95.25 142.24,87.63 142.24,30.48 SENSOR_SOLO3.3
N$10
  Top 0.61: IC1.33 104,68.31 J3.1 111.73,68.31 R2.1
N$16
  Bottom 0.61: IC1.3 88.9,80.01 90.17,81.28 90.17,87.63 85.09,92.71 SENSOR_CHUVA.3
N$18
  Bottom 0.61: IC1.4 88.9,77.47 91.44,80.01 91.44,87.63 106.68,102.87 SENSOR_AGUA.3
N$21
  Top 1.016: K1.4 14.09,77.47 SOL_SAIDA_AGUA_4.1
N$22  (1 unrouted)
  Top 0.406: R9.1 44.45,58.42
N$24
  Top 0.406: R6.1 44.45,75.98 LED5.A
N$25
  Top 0.406: Q1.1 48.55,68.88 R6.2 42.05,68.88 C8.1 40.56,67.66 K1.2
N$26
  Top 1.016: K1.5 18.47,85.09 SOL_SAIDA_AGUA_4.2
N$27
  Top 0.406: Q5.1 48.55,33.31 R8.2 42.05,33.31 C13.1 40.56,32.1 K5.2
N$30
  Top 1.016: K5.5 23.9,41.68 19.05,36.83 SOL_SAIDA_AGUA.2
N$32
  Top 0.406: Q3.1 48.55,51.09 R9.2 42.05,51.09 C10.1 40.56,49.88 K3.2
N$33
  Top 0.406: R7.1 44.45,22.64 LED6.A
N$34
  Top 0.406: Q2.1 48.55,15.54 R7.2 42.05,15.54 C9.1 40.56,14.32 K2.2
N$35
  Top 1.016: K2.4 23.9,11.2 17.78,5.08 SOL_SAIDA_AGUA2.1
N$36
  Top 1.016: K2.5 23.9,20.09 16.51,12.7 SOL_SAIDA_AGUA2.2
N$37
  Top 0.406: LED7.A 44.45,40.42 R8.1
N$38
  Top 1.016: K3.4 12.35,49.88 SOL_SAIDA_AGUA_3.1
N$39
  Top 1.016: K3.5 9.81,61.88 SOL_SAIDA_AGUA_3.2
N$53
  Bottom 0.61: SENSOR_LUZ.3 133.35,99.06 132.08,97.79 104.14,97.79 92.71,86.36 92.71,77.47 90.17,74.93 IC1.5
OUTPUT1_MOTOR_1
  Top 1.016: IC3.3 105.41,24.72 105.41,15.24 111.76,8.89 SAIDA_MOTOR_1.3
OUTPUT1_MOTOR_2
  Top 1.016: IC3.11 96.52,12.7 SAIDA_MOTOR_2.3
OUTPUT1_MOTOR_3
  Top 1.016: SAIDA_MOTOR_3.3 46.99,6.35 69.85,6.35 80.01,16.51 80.01,24.72 IC4.3
OUTPUT1_MOTOR_4
  Top 1.016: IC4.11 73.66,13.97 SAIDA_MOTOR_4.3
OUTPUT2_MOTOR_1
  Top 1.016: SAIDA_MOTOR_1.1 130.22,7.03 106.48,7.03 106.28,7.22 97.79,15.72 97.79,24.72 IC3.6
OUTPUT2_MOTOR_2
  Top 1.016: IC3.14 104.14,13.97 104.14,12.7 SAIDA_MOTOR_2.1
OUTPUT2_MOTOR_3
  Top 1.27: SAIDA_MOTOR_3.1 59.69,12.02 IC4.6
OUTPUT2_MOTOR_4
  Top 1.016: IC4.14 81.28,11.43 SAIDA_MOTOR_4.1
RB1
  Top 0.61: IC1.34 116.84,69.85 121.92,64.77 J2.6
RB2
  Bottom 0.61: IC1.35 111.76,72.39 124.46,59.69 J2.4
RB4
  Top 0.61: IC1.37 J2.11
RB5
  Top 0.61: IC1.38 J2.12
RB6
  Top 0.61: IC1.39 J2.13
RB7
  Top 0.61: IC1.40 J2.14
VCC
  Top 1.27: J1.1 18.1,108.64 S1.2
VCC5  (1 unrouted)
  Top 0.61: 123.3,87.63 C18.1 | IC2.3 35.14,107.52 C2.1 41.07,107.52 SENSOR_SOLO.1 | Q2.3 52.07,24.13 52.07,39.37 Q5.3 52.07,41.91 52.07,57.15 Q3.3 52.07,59.69 52.07,74.93 Q1.3 67.74,76.2 S2.1 75.63,81.57 R1.1 83.82,77.76 C7.1 87.07,59.26 IC1.11 92.71,59.69 97.79,64.77 IC1.32 106.25,64.77 C6.1 109.22,64.34 115.6,64.34 122.06,57.88 122.06,57.85 C12.1 J2.3 | C18.1 121.49,88.06 118.11,91.44 SENSOR_LUZ.1 | IC4.16 86.36,16.51 87.2,15.67 C15.2 | IC3.16 109.22,16.51 110.06,15.67 C14.1 117.27,15.67 123.19,21.59 123.19,51.64 C11.1 J2.1 | J2.1 129.55,53.35 129.55,55.87 J2.3 | C18.1 123.62,87.63 J2.15 SENSOR_SOLO1.1 | J2.3 130.81,59.69 130.81,60.96 133.35,63.5 SENSOR_SOLO2.1 | J2.1 135.89,44.45 SENSOR_SOLO3.1
  Top 0.813: S2.1 69.85,87.35 SENSOR_CHUVA.1
  Bottom 0.61: SENSOR_LUZ.1 115.57,105.41 96.52,105.41 SENSOR_AGUA.1 91.44,105.41 72.39,105.41 SENSOR_CHUVA.1 67.31,105.41 48.26,105.41 SENSOR_SOLO.1 | IC3.16 107.27,15.24 88.31,15.24 IC4.16
VCC12
  Top 1.27: S1.1 20.32,97.79 23.59,94.52 D1.2 27.94,83.82 K1.1 33.02,68.58 33.02,60.96 K3.1 33.02,50.8 33.02,43.18 K5.1 33.02,33.02 33.02,25.4 K2.1 33.02,15.24 33.02,13.97 34.29,12.7 50.8,12.7 52.07,12.7 55.29,12.7 IC4.8 C16.2 | C17.2 IC3.8
  Bottom 1.27: IC4.8 70.44,24.13 89.58,24.13 IC3.8